# EAGLE design DUE_Xbee_v1 (EAGLE 9.6.2)
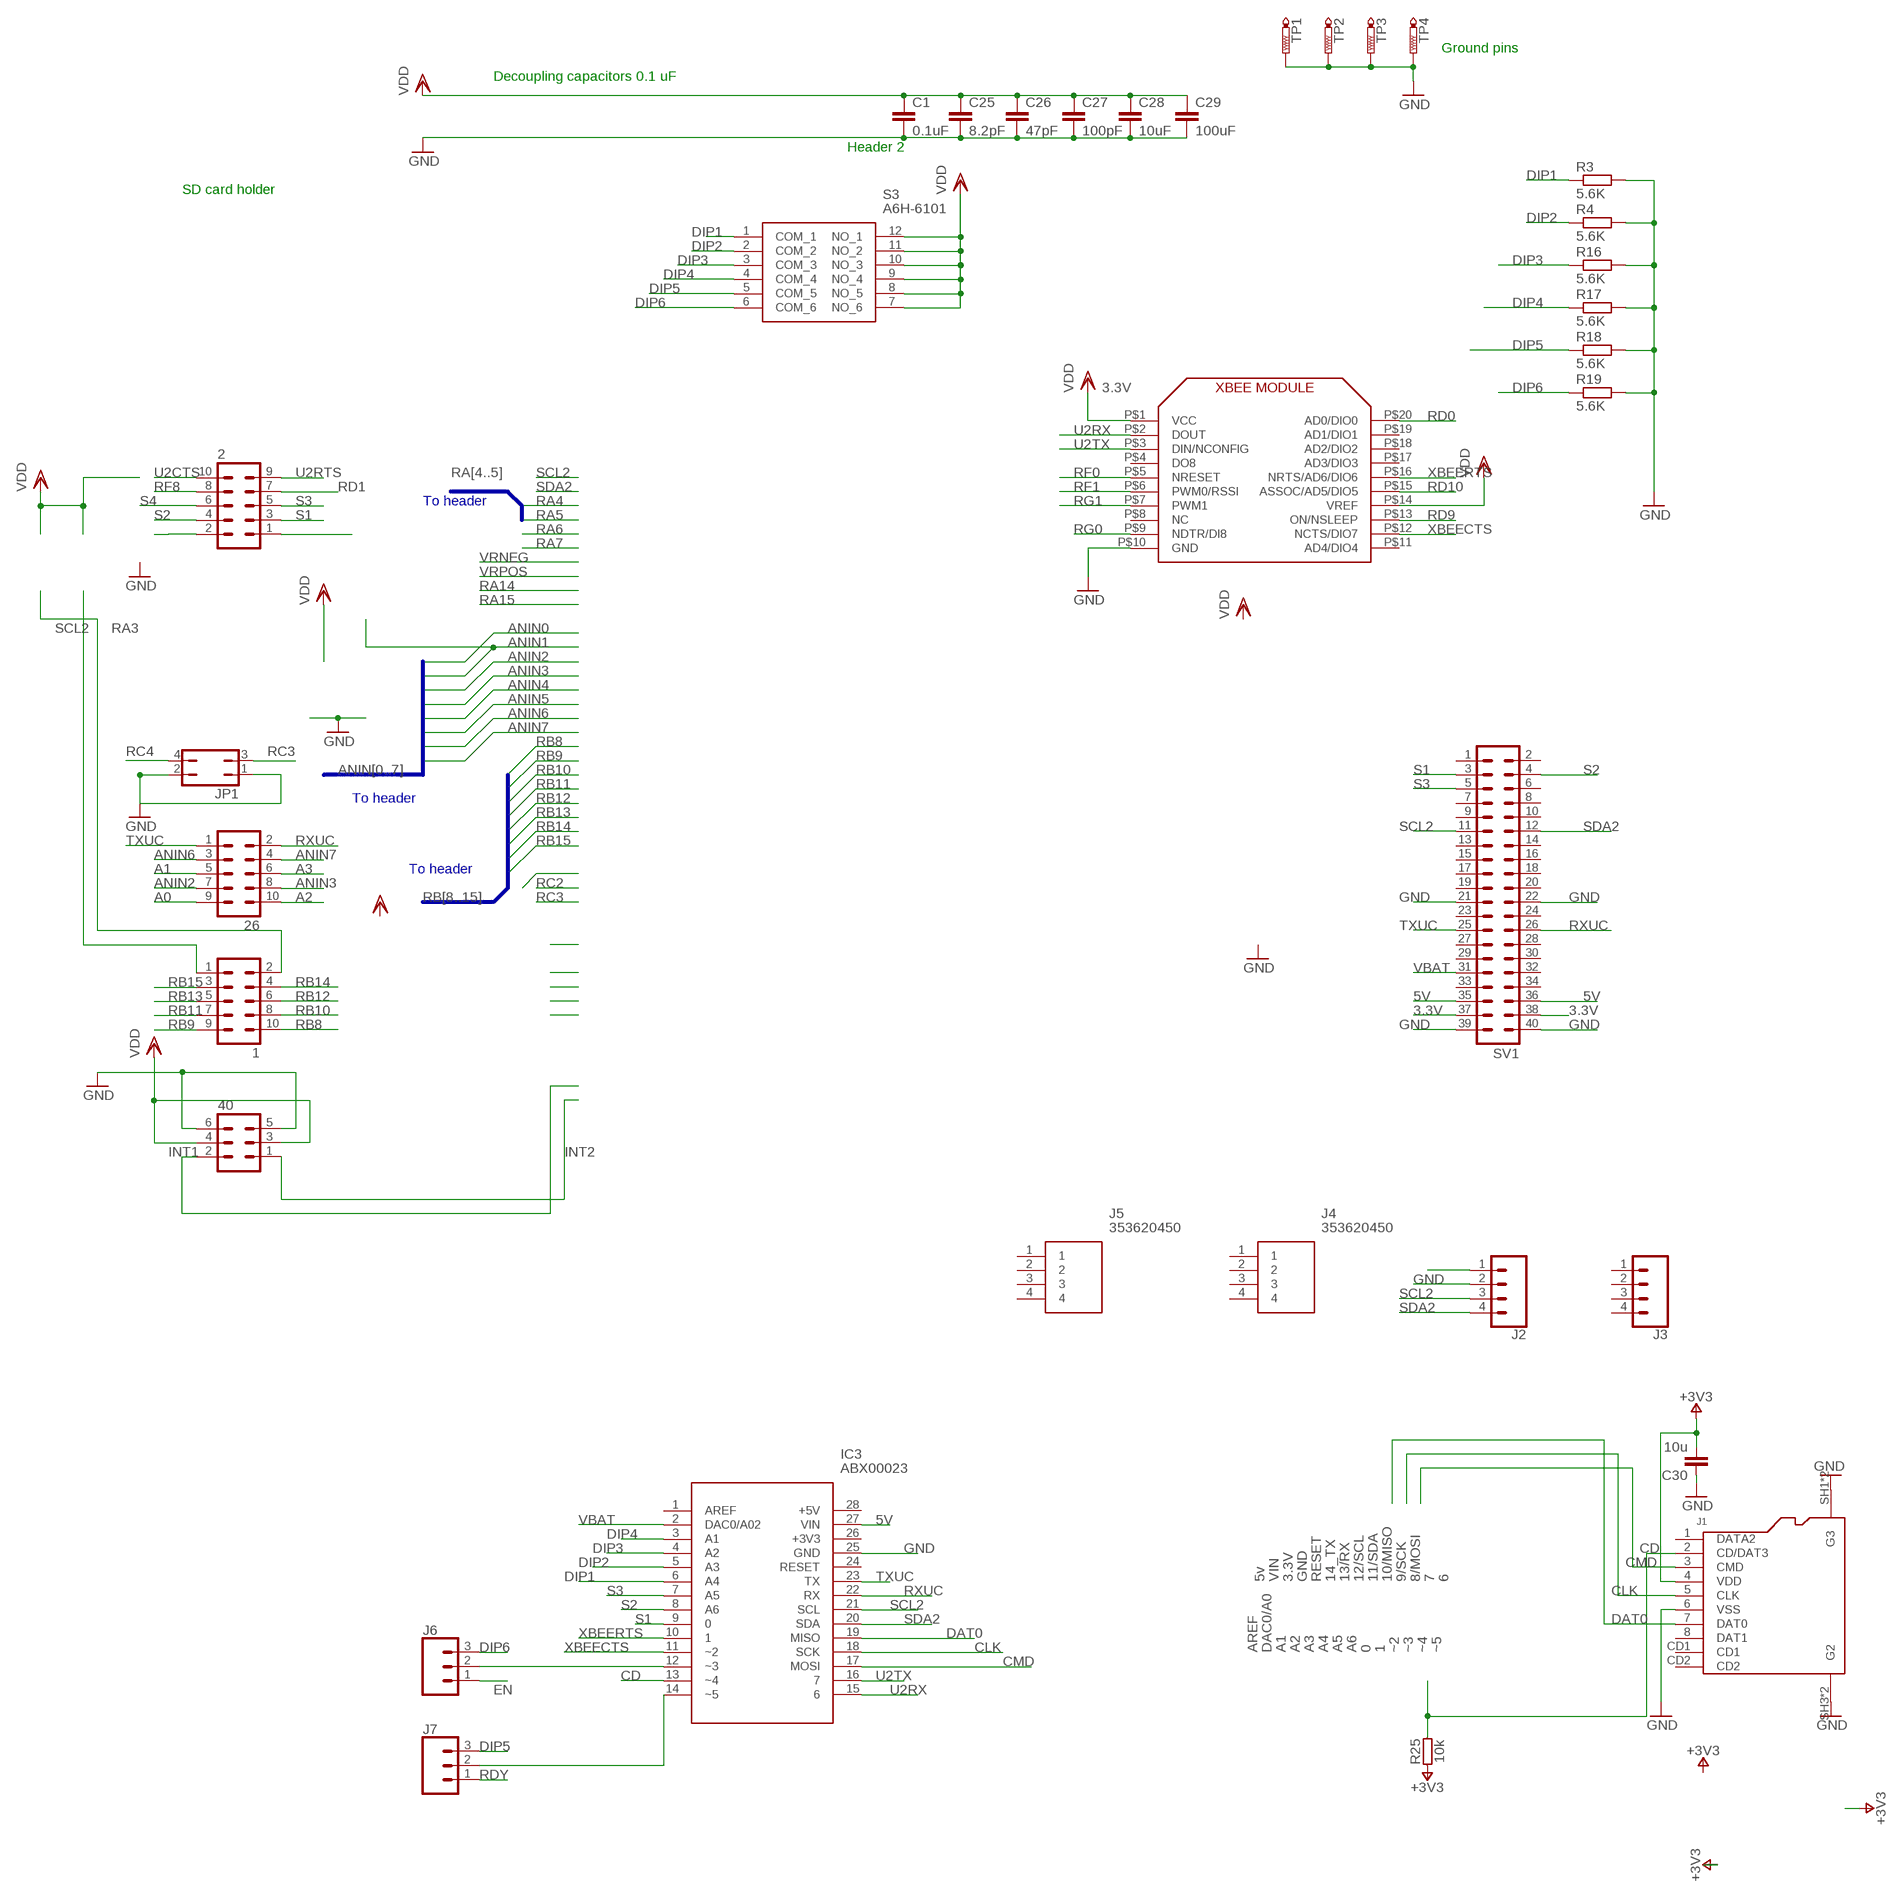
[diagram p0: schematic, sheet 1, part 1 of 2]
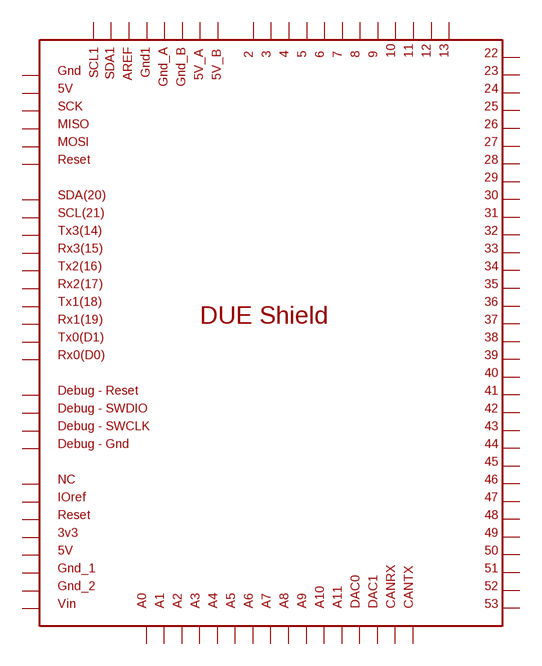
[diagram p1: schematic, sheet 1, part 2 of 2]

## Parts
1  MA05-2  [MA05-2]
2  MA05-2  [MA05-2]
26  MA05-2  [MA05-2]
40  MA03-2  [MA03-2]
C1  0.1uF  C-EUC0805K  [C0805K]
C25  8.2pF  C-EUC0805K  [C0805K]
C26  47pF  C-EUC0805K  [C0805K]
C27  100pF  C-EUC0805K  [C0805K]
C28  10uF  C-EUC0805K  [C0805K]
C29  100uF  C-EUC0805K  [C0805K]
C30  10u  C-22U-0805  [0805-R2013X50N]
IC3  ABX00023  [ABX00023]
J1  AMPHENOL_114-00841-68  [AMPHENOL_114-00841-68]
J2  CONN_04POLAR_LOCK  [MOLEX-1X4_LOCK]
J3  CONN_04POLAR_LOCK  [MOLEX-1X4_LOCK]
J4  353620450  [SHDR4W50P0X200_1X4_1030X550X85]
J5  353620450  [SHDR4W50P0X200_1X4_1030X550X85]
J6  CONN_03LOCK  [1X03_LOCK]
J7  CONN_03LOCK  [1X03_LOCK]
JP1  JP2Q  [JP2Q]
R3  5.6K  R-EU_R0805  [R0805]
R4  5.6K  R-EU_R0805  [R0805]
R16  5.6K  R-EU_R0805  [R0805]
R17  5.6K  R-EU_R0805  [R0805]
R18  5.6K  R-EU_R0805  [R0805]
R19  5.6K  R-EU_R0805  [R0805]
R25  10k  R-DNP-0805  [0805-R2013X50N]
S3  A6H-6101  [A6H6101]
SV1  ML40  [ML40]
TP1  PTR1PAD1-13  [P1-13]
TP2  PTR1PAD1-13  [P1-13]
TP3  PTR1PAD1-13  [P1-13]
TP4  PTR1PAD1-13  [P1-13]
U$1  XBEE  [XBEE]
U$2  DUE(NORMAL)  [DUE(NORMAL)]

## Nets
3.3V: 40.3 40.4 C1.1 C25.1 C26.1 C27.1 C28.1 C29.1 J2.1 S3.7(NO_6) S3.8(NO_5) S3.9(NO_4) S3.10(NO_3) S3.11(NO_2) S3.12(NO_1) SV1.37 SV1.38 U$1.P$1(VCC) U$1.P$14(VREF) ; supply symbol labelled VDD
5V: IC3.27(VIN) SV1.35 SV1.36
+3V3: C30.2 J1.4(VDD) R25.1
A0: 26.9
A1: 26.5
A2: 26.10
A3: 26.6
ANIN2: 26.7
ANIN3: 26.8
ANIN6: 26.3
ANIN7: 26.4
CD: IC3.13(~4) J1.2(CD/DAT3) R25.2
CLK: IC3.18(SCK) J1.5(CLK)
CMD: IC3.17(MOSI) J1.3(CMD)
DAT0: IC3.19(MISO) J1.7(DAT0)
DIP1: IC3.6(A4) R3.1 S3.1(COM_1)
DIP2: IC3.5(A3) R4.1 S3.2(COM_2)
DIP3: IC3.4(A2) R16.1 S3.3(COM_3)
DIP4: IC3.3(A1) R17.1 S3.4(COM_4)
DIP5: J7.3 R18.1 S3.5(COM_5)
DIP6: J6.3 R19.1 S3.6(COM_6)
EN: J6.1
GND: 40.5 40.6 C1.2 C25.2 C26.2 C27.2 C28.2 C29.2 C30.1 IC3.25(GND) J1.6(VSS) J1.SH1(G3) J1.SH2(G3) J1.SH3(G2) J1.SH4(G2) J2.2 JP1.1 JP1.2 R3.2 R4.2 R16.2 R17.2 R18.2 R19.2 SV1.21 SV1.22 SV1.39 SV1.40 TP1.1(TP) TP2.1(TP) TP3.1(TP) TP4.1(TP) U$1.P$10(GND)
INT1: 40.2
INT2: 40.1
N$1: 2.2
N$2: IC3.12(~3) J6.2
N$5: 2.1
N$9: IC3.14(~5) J7.2
RA3: 1.2
RB8: 1.10
RB9: 1.9
RB10: 1.8
RB11: 1.7
RB12: 1.6
RB13: 1.5
RB14: 1.4
RB15: 1.3
RC3: JP1.3
RC4: JP1.4
RD0: U$1.P$20(AD0/DIO0)
RD1: 2.7
RD9: U$1.P$13(ON/NSLEEP)
RD10: U$1.P$15(ASSOC/AD5/DIO5)
RDY: J7.1
RF0: U$1.P$5(NRESET)
RF1: U$1.P$6(PWM0/RSSI)
RF8: 2.8
RG0: U$1.P$9(NDTR/DI8)
RG1: U$1.P$7(PWM1)
RXUC: 26.2 IC3.22(RX) SV1.26
S1: 2.3 IC3.9 SV1.3
S2: 2.4 IC3.8(A6) SV1.4
S3: 2.5 IC3.7(A5) SV1.5
S4: 2.6
SCL2: 1.1 IC3.21(SCL) J2.3 SV1.11
SDA2: IC3.20(SDA) J2.4 SV1.12
TXUC: 26.1 IC3.23(TX) SV1.25
U2CTS: 2.10
U2RTS: 2.9
U2RX: IC3.15 U$1.P$2(DOUT)
U2TX: IC3.16 U$1.P$3(DIN/NCONFIG)
VBAT: IC3.2(DAC0/A02) SV1.31
XBEECTS: IC3.11(~2) U$1.P$12(NCTS/DIO7)
XBEERTS: IC3.10 U$1.P$16(NRTS/AD6/DIO6)
Unconnected: IC3.1(AREF) IC3.24(RESET) IC3.26(+3V3) IC3.28(+5V) J1.1(DATA2) J1.8(DAT1) J1.CD1 J1.CD2 J3.1 J3.2 J3.3 J3.4 J4.1 J4.2 J4.3 J4.4 J5.1 J5.2 J5.3 J5.4 SV1.1 SV1.2 SV1.6 SV1.7 SV1.8 SV1.9 SV1.10 SV1.13 SV1.14 SV1.15 SV1.16 SV1.17 SV1.18 SV1.19 SV1.20 SV1.23 SV1.24 SV1.27 SV1.28 SV1.29 SV1.30 SV1.32 SV1.33 SV1.34 U$1.P$4(DO8) U$1.P$8(NC) U$1.P$11(AD4/DIO4) U$1.P$17(AD3/DIO3) U$1.P$18(AD2/DIO2) U$1.P$19(AD1/DIO1) U$2.2 U$2.3 U$2.3V3 U$2.4 U$2.5 U$2.5V U$2.5V_A U$2.5V_B U$2.5V_ICSP U$2.6 U$2.7 U$2.8 U$2.9 U$2.10 U$2.11 U$2.12 U$2.13 U$2.22 U$2.23 U$2.24 U$2.25 U$2.26 U$2.27 U$2.28 U$2.29 U$2.30 U$2.31 U$2.32 U$2.33 U$2.34 U$2.35 U$2.36 U$2.37 U$2.38 U$2.39 U$2.40 U$2.41 U$2.42 U$2.43 U$2.44 U$2.45 U$2.46 U$2.47 U$2.48 U$2.49 U$2.50 U$2.51 U$2.52 U$2.53 U$2.A0 U$2.A1 U$2.A2 U$2.A3 U$2.A4 U$2.A5 U$2.A6 U$2.A7 U$2.A8 U$2.A9 U$2.A10 U$2.A11 U$2.AREF U$2.CANRX U$2.CANTX U$2.DAC0 U$2.DAC1 U$2.GND1 U$2.GND_1 U$2.GND_2 U$2.GND_A U$2.GND_B U$2.GND_DEBUG U$2.GND_ICSP U$2.IOREF U$2.MISO_ICSP U$2.MOSI_ICSP U$2.NC U$2.RESET U$2.RESET_DEBUG U$2.RESET_ICSP U$2.RX0 U$2.RX1 U$2.RX2 U$2.RX3 U$2.SCK_ICSP U$2.SCL U$2.SCL1 U$2.SDA U$2.SDA1 U$2.SWCLK_DEBUG U$2.SWDIO_DEBUG U$2.TX0 U$2.TX1 U$2.TX2 U$2.TX3 U$2.VIN

## Buses
ANIN[0..7]
RB[8..15]
RA[4..5]

## Notes on the sheet
- Ground pins
- Decoupling capacitors 0.1 uF
- Header 2
- SD card holder
- To header
- To header
- To header
- 5v | VIN | 3.3V | GND | RESET | 14_TX | 13/RX | 12/SCL | 11/SDA | 10/MISO | 9/SCK | 8/MOSI | 7 | 6
- AREF | DAC0/A0 | A1 | A2 | A3 | A4 | A5 | A6 | 0 | 1 | ~2 | ~3 | ~4 | ~5

## Library data of the parts
1 2 26 = con-lstb:MA05-2: PIN HEADER
40 = con-lstb:MA03-2: PIN HEADER
C1 C25-C29 = rcl:C-EU: CAPACITOR, European symbol
C30 = Arduino-rcl:C: SMD Capacitor; DATASHEET: https://media.digikey.com/pdf/Data%20Sheets/Samsung%20PDFs/CL21A226MQCLQNC_character.pdf; DISTRIBUTOR-LINK: https://www.digikey.com/product-detail/en/samsung-electro-mechanics-america-inc/CL21A226MQCLQNC/1276-2412-1-ND/3890498; DISTRIBUTOR-PN: 1276-2412-1-ND; MANUFACTURER: Samsung; MANUFACTURER-PN: CL21A226MQCLQNC; VALUE: 22u
IC3 = SamacSys_Parts:ABX00023: ARDUINO MKR WIFI 1010 Source: Datasheet <https://store.arduino.cc/arduino-mkr-wifi-1010>; ARROW_PART_NUMBER: ABX00023; ARROW_PRICE-STOCK: https://www.arrow.com/en/products/abx00023/arduino-corporation; DESCRIPTION: ARDUINO MKR WIFI 1010; HEIGHT: 3mm; MANUFACTURER_NAME: Arduino; MANUFACTURER_PART_NUMBER: ABX00023; MOUSER_PART_NUMBER: 782-ABX00023; MOUSER_PRICE-STOCK: https://www.mouser.co.uk/ProductDetail/Arduino/ABX00023?qs=%252BEew9%252B0nqrAwxv2YQYWyPw%3D%3D
J1 = Arduino-connectors:AMPHENOL_114-00841-68
J2 J3 = SparkFun-Connectors:CONN_04: Multi connection point. Often used as Generic Header-pin footprint for 0.1 inch spaced/style header connections On any of the 0.1 inch spaced packages, you can populate with these: Break Away Headers - Straight <https://www.sparkfun.com/products/116> (PRT-00116) Break Away Male Headers - Right Angle <https://www.sparkfun.com/products/553> (PRT-00553) Female Headers <https://www.sparkfun.com/products/115> (PRT-00115) Break Away Headers - Machine Pin <https://www.sparkfun.com/products/117> (PRT-00117) Break Away Female Headers - Swiss Machine Pin <https://www.sparkfun.com/products/743> (PRT-00743) For SCREWTERMINALS and SPRING TERMINALS visit here: Screw Terimnals on SparkFun.com <https://www.sparkfun.com/search/results?term=Screw+Terminals> (5mm/3.5mm/2.54mm spacing) This device is also useful as a general connection point to wire up your design to another part of your project. Our various solder wires solder well into these plated through hole pads. Hook-Up Wire - Assortment (Stranded, 22 AWG) <https://www.sparkfun.com/products/11375> (PRT-11375) Hook-Up Wire - Assortment (Solid Core, 22 AWG) <https://www.sparkfun.com/products/11367> (PRT-11367) View the entire wire category on our website here <https://www.sparkfun.com/categories/141> Special notes: Molex polarized connector foot print use with SKU : PRT-08231 with associated crimp pins and housings. 1MM SMD Version SKU: PRT-10208; PROD_ID: CONN-08186; SF_ID: PRT-08231
J4 J5 = SamacSys_Parts:353620450: MOLEX - 353620450 - CONNECTOR, HEADER, 4POS, 1ROW, 2MM Source: Datasheet <https://www.molex.com/pdm_docs/sd/353620450_sd.pdf>; DESCRIPTION: MOLEX - 353620450 - CONNECTOR, HEADER, 4POS, 1ROW, 2MM; HEIGHT: 8.5mm; MANUFACTURER_NAME: Molex; MANUFACTURER_PART_NUMBER: 353620450
J6 J7 = SparkFun-Connectors:CONN_03: Multi connection point. Often used as Generic Header-pin footprint for 0.1 inch spaced/style header connections On any of the 0.1 inch spaced packages, you can populate with these: Break Away Headers - Straight <https://www.sparkfun.com/products/116> (PRT-00116) Break Away Male Headers - Right Angle <https://www.sparkfun.com/products/553> (PRT-00553) Female Headers <https://www.sparkfun.com/products/115> (PRT-00115) Break Away Headers - Machine Pin <https://www.sparkfun.com/products/117> (PRT-00117) Break Away Female Headers - Swiss Machine Pin <https://www.sparkfun.com/products/743> (PRT-00743) Stackable Header - 3 Pin (Female, 0.1") <https://www.sparkfun.com/products/13875> (PRT-13875) For SCREWTERMINALS and SPRING TERMINALS visit here: Screw Terimnals on SparkFun.com <https://www.sparkfun.com/search/results?term=Screw+Terminals> (5mm/3.5mm/2.54mm spacing) This device is also useful as a general connection point to wire up your design to another part of your project. Our various solder wires solder well into these plated through hole pads. Hook-Up Wire - Assortment (Stranded, 22 AWG) <https://www.sparkfun.com/products/11375> (PRT-11375) Hook-Up Wire - Assortment (Solid Core, 22 AWG) <https://www.sparkfun.com/products/11367> (PRT-11367) View the entire wire category on our website here <https://www.sparkfun.com/categories/141> Special notes: Molex polarized connector foot print use with SKU : PRT-08232 with associated crimp pins and housings.
JP1 = jumper:JP2Q: JUMPER
R3 R4 R16-R19 = rcl:R-EU_: RESISTOR, European symbol
R25 = Arduino-rcl:R: SMD Resistor; DATASHEET: DNP; DISTRIBUTOR-LINK: DNP; DISTRIBUTOR-PN: DNP; MANUFACTURER: DNP; MANUFACTURER-PN: DNP; VALUE: DNP
S3 = SamacSys_Parts:A6H-6101: OMRON ELECTRONIC COMPONENTS - A6H-6101 - SWITCH, DIP, 1/2 PITCH, SMD Source: Datasheet <http://omronfs.omron.com/en_US/ecb/products/pdf/en-a6h.pdf>; ARROW_PART_NUMBER: A6H-6101; ARROW_PRICE-STOCK: https://www.arrow.com/en/products/a6h-6101/omron?region=nac; DESCRIPTION: OMRON ELECTRONIC COMPONENTS - A6H-6101 - SWITCH, DIP, 1/2 PITCH, SMD; HEIGHT: 1.55mm; MANUFACTURER_NAME: Omron Electronics; MANUFACTURER_PART_NUMBER: A6H-6101; MOUSER_PART_NUMBER: 653-A6H-6101; MOUSER_PRICE-STOCK: https://www.mouser.co.uk/ProductDetail/Omron-Electronics/A6H-6101?qs=HDDQUw%2F3PhptqbHjvn4x5A%3D%3D
SV1 = con-harting-ml:ML40: HARTING; OC_FARNELL: unknown; OC_NEWARK: unknown
TP1-TP4 = testpad:PTR1: TEST PIN
U$1 = XBEE:XBEE
U$2 = DUElib130425:DUE(NORMAL)

## Board
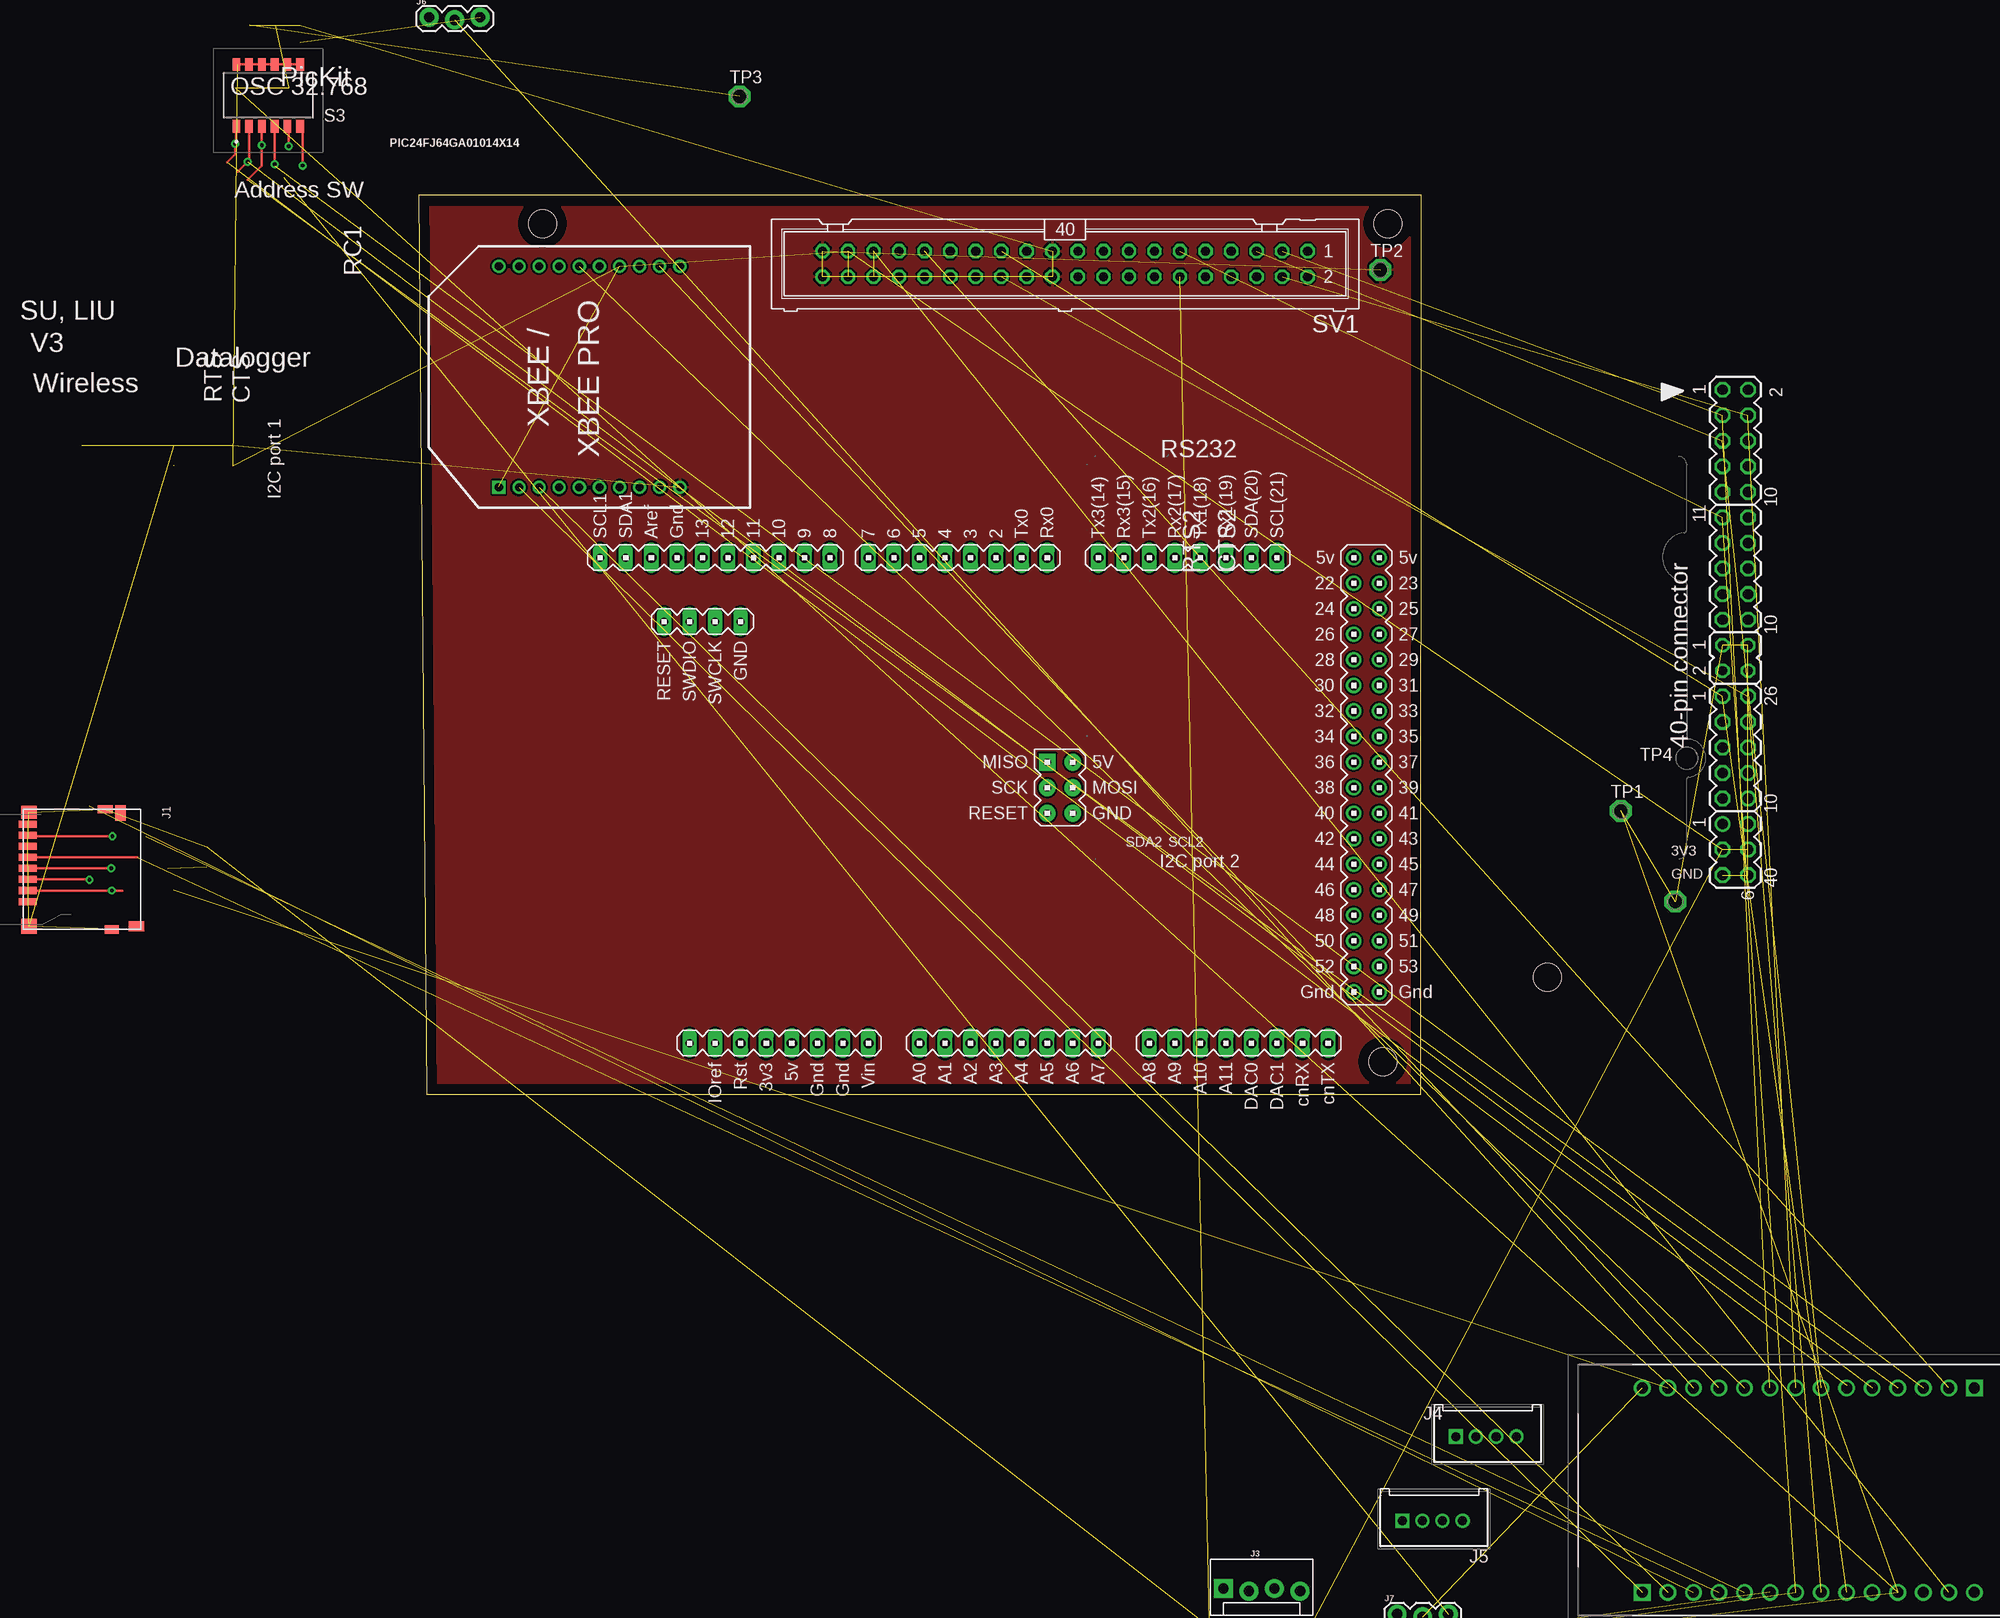
[diagram p2: board, top side]
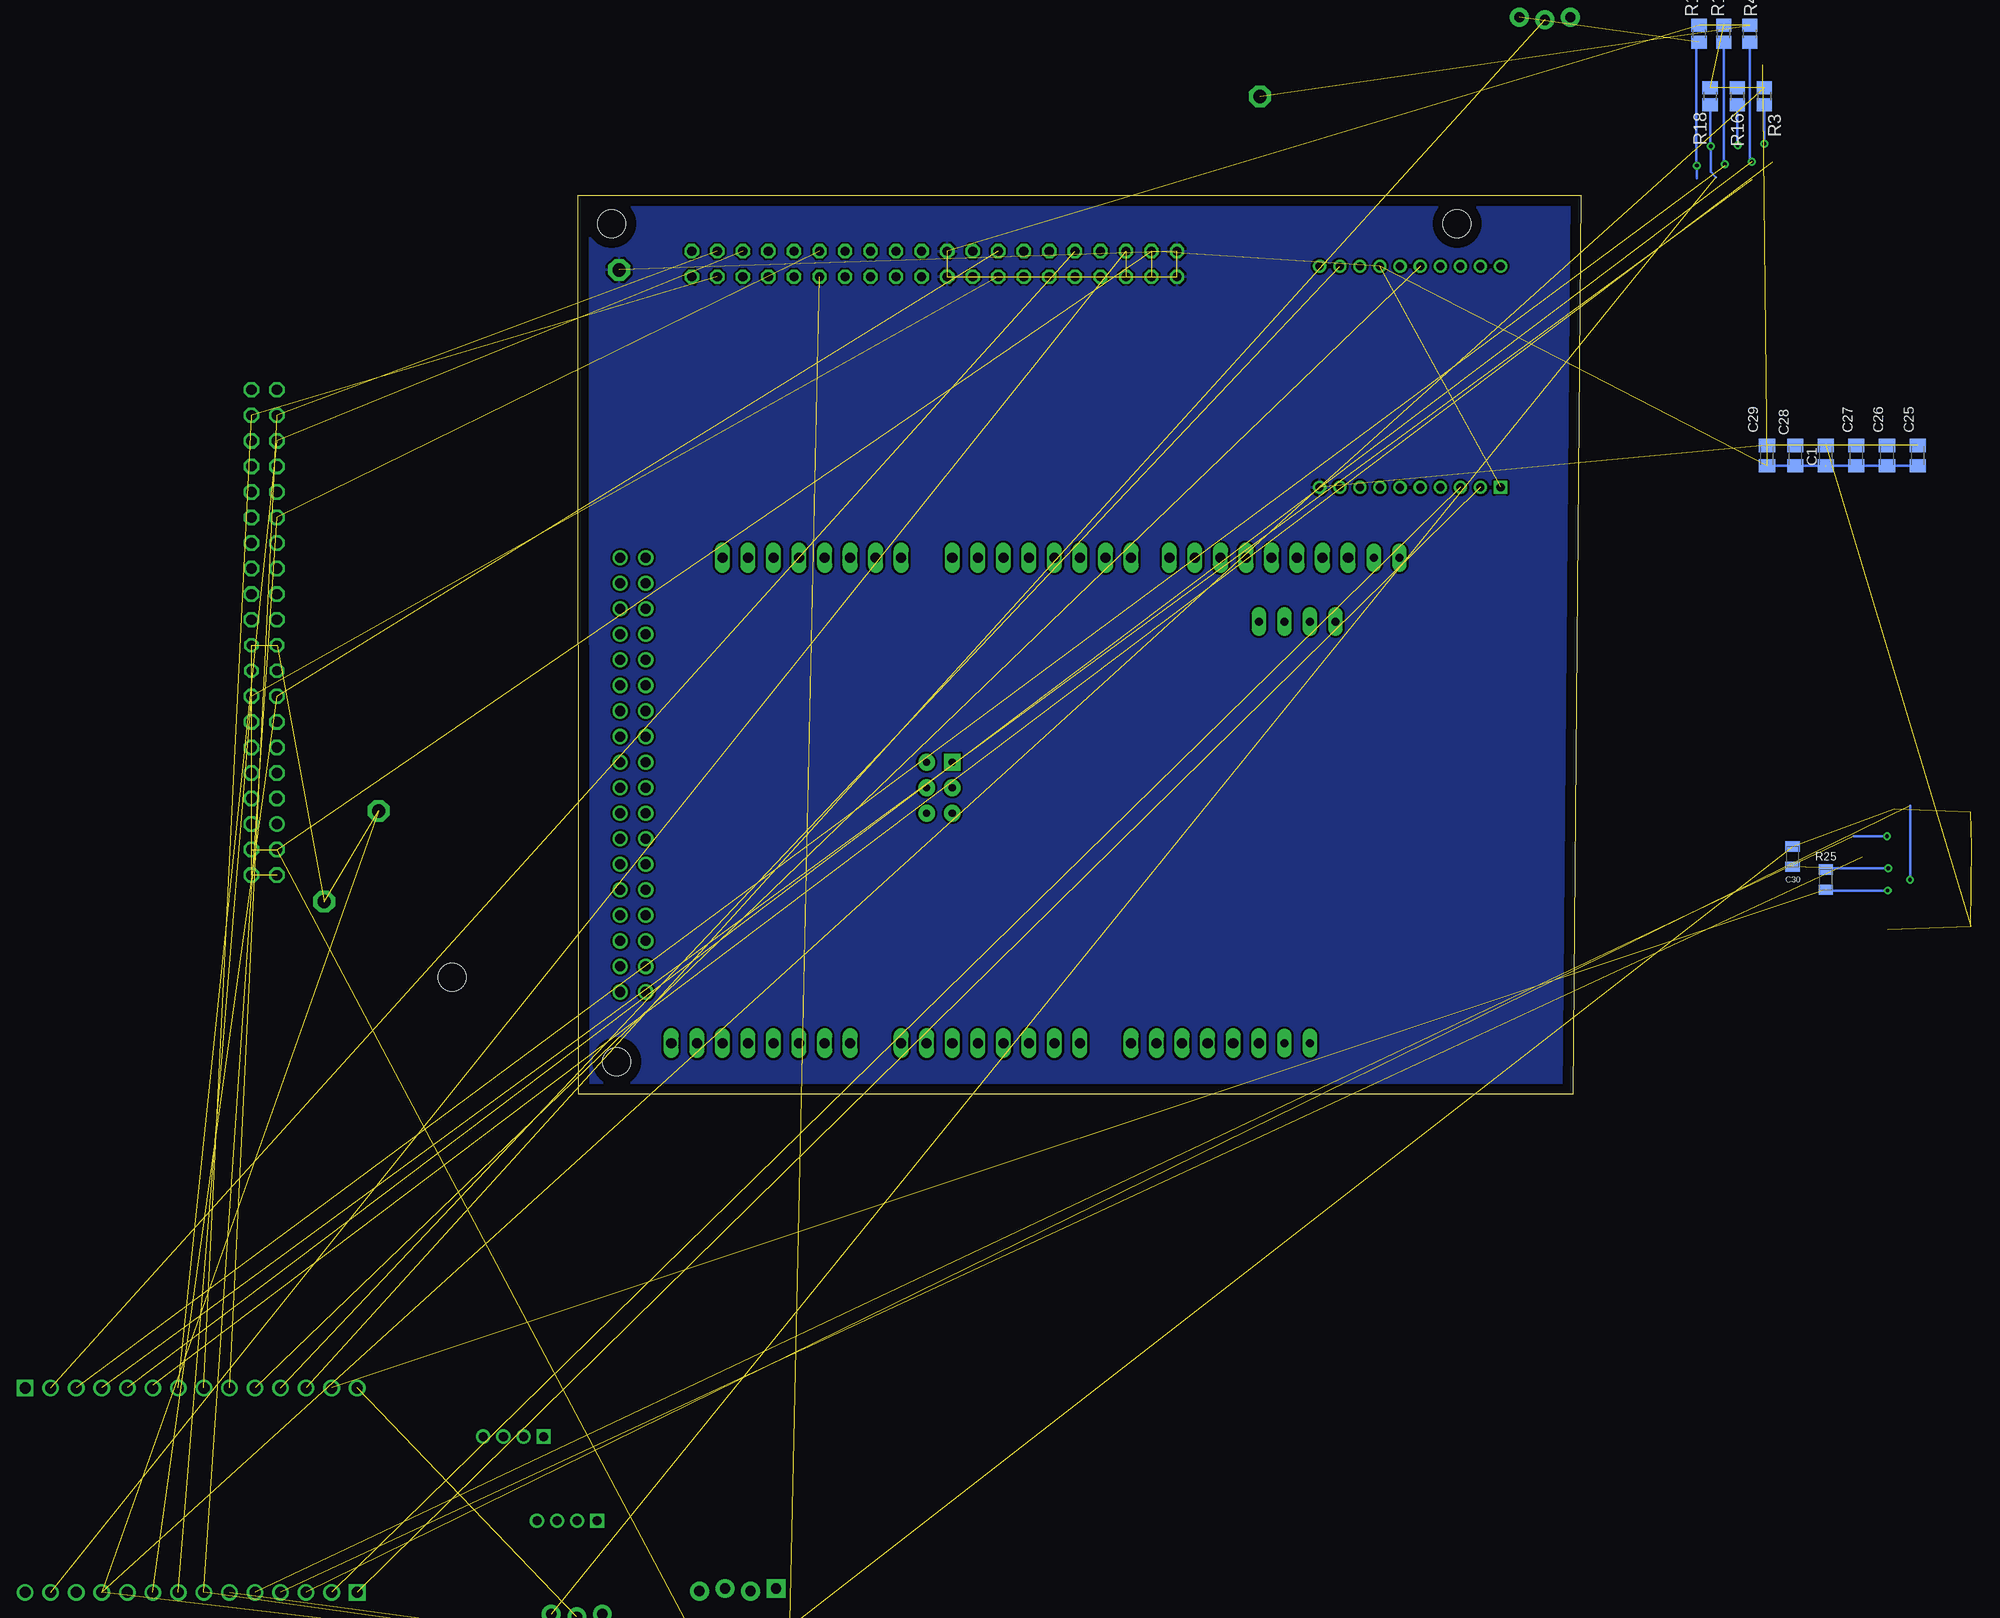
[diagram p3: board, bottom side, seen from below]

Size 99.73 x 89.42 mm. Coordinates in mm from the lower left corner, seen from the top.
Outline: 0.8,0.02 99.68,0 99.73,89.42 0,89.42 0.8,0.02
Copper layers (1*16): Top 0.035mm / dielectric 1.5mm / Bottom 0.035mm
Design rules "default": minimum track width 10mil, minimum drill 15mil, track to track 8mil, track to pad 8mil, pad to pad 8mil, via to via 8mil, smd to smd 8mil, copper to edge 40mil, drill to drill 8mil, minimum pad ring 10mil, minimum via ring 8mil, stop-mask expansion 4mil, vias tented up to drill 0mil, thermal gap 10mil
Holes 2.8 mm at 95.89,3.26 96.4,86.57 12.33,86.57 112.24,11.64

### Footprints (pad centres in the part's own frame; a part is rotated, then mirrored left to right if it is on the bottom)
MA05-2 = drill 1.016 octagon: 1 -5.08,-1.27; 2 -5.08,1.27; 3 -2.54,-1.27; 4 -2.54,1.27; 5 0,-1.27; 6 0,1.27; 7 2.54,-1.27; 8 2.54,1.27; 9 5.08,-1.27; 10 5.08,1.27
MA03-2 = drill 1.016: 1 -2.54,-1.27 | drill 1.016 octagon: 2 -2.54,1.27; 3 0,-1.27; 4 0,1.27; 5 2.54,-1.27; 6 2.54,1.27
C0805K = smd 1.3 x 1.6: 1 -1,0; 2 1,0
0805-R2013X50N = smd 0.95 x 1.45: 1 -1,0; 2 1,0
ABX00023 = drill 1.1 pad 1.65 square: 1 0,0; 15 33.02,20.32 | drill 1.1 pad 1.65: 2 2.54,0; 3 5.08,0; 4 7.62,0; 5 10.16,0; 6 12.7,0; 7 15.24,0; 8 17.78,0; 9 20.32,0; 10 22.86,0; 11 25.4,0; 12 27.94,0; 13 30.48,0; 14 33.02,0; 16 30.48,20.32; 17 27.94,20.32; 18 25.4,20.32; 19 22.86,20.32; 20 20.32,20.32; 21 17.78,20.32; 22 15.24,20.32; 23 12.7,20.32; 24 10.16,20.32; 25 7.62,20.32; 26 5.08,20.32; 27 2.54,20.32; 28 0,20.32
AMPHENOL_114-00841-68 = smd 0.7 x 1.75: 1 3.2,-5.888; 2 2.1,-5.888; 3 1,-5.888; 4 -0.1,-5.888; 5 -1.2,-5.888; 6 -2.3,-5.888; 7 -3.4,-5.888; 8 -4.5,-5.888 | smd 1 x 1.55: CD1 5.65,4.912 | smd 1.55 x 1: CD2 -5.602,3.337 | smd 1.3 x 1.5: SH1 -5.7,-5.76 | smd 1.5 x 1.5: SH2 5.65,-5.76 | smd 0.8 x 1.4: SH3 5.975,2.487 | smd 0.8 x 1.5: SH4 -5.975,1.837
MOLEX-1X4_LOCK = drill 1.016 pad 1.88 square: 1 0,0.127 | drill 1.016 pad 1.88: 2 2.54,-0.127; 3 5.08,0.127; 4 7.62,-0.127
SHDR4W50P0X200_1X4_1030X550X85 = drill 0.9 pad 1.35 square: 1 0,0 | drill 0.9 pad 1.35: 2 -2,0; 3 -4,0; 4 -6,0
1X03_LOCK = drill 1.016 pad 1.88: 1 0,0.127; 2 2.54,-0.127; 3 5.08,0.127
JP2Q = drill 0.914 octagon: 1 -1.27,-1.27; 2 -1.27,1.27; 3 1.27,-1.27; 4 1.27,1.27
R0805 = smd 1.3 x 1.5: 1 -0.85,0; 2 0.85,0
A6H6101 = smd 0.76 x 1.25: 1 -3.175,-3.075; 2 -1.905,-3.075; 3 -0.635,-3.075; 4 0.635,-3.075; 5 1.905,-3.075; 6 3.175,-3.075; 7 3.175,3.075; 8 1.905,3.075; 9 0.635,3.075; 10 -0.635,3.075; 11 -1.905,3.075; 12 -3.175,3.075
ML40 = drill 0.914 octagon: 1 -24.13,-1.27; 2 -24.13,1.27; 3 -21.59,-1.27; 4 -21.59,1.27; 5 -19.05,-1.27; 6 -19.05,1.27; 7 -16.51,-1.27; 8 -16.51,1.27; 9 -13.97,-1.27; 10 -13.97,1.27; 11 -11.43,-1.27; 12 -11.43,1.27; 13 -8.89,-1.27; 14 -8.89,1.27; 15 -6.35,-1.27; 16 -6.35,1.27; 17 -3.81,-1.27; 18 -3.81,1.27; 19 -1.27,-1.27; 20 -1.27,1.27; 21 1.27,-1.27; 22 1.27,1.27; 23 3.81,-1.27; 24 3.81,1.27; 25 6.35,-1.27; 26 6.35,1.27; 27 8.89,-1.27; 28 8.89,1.27; 29 11.43,-1.27; 30 11.43,1.27; 31 13.97,-1.27; 32 13.97,1.27; 33 16.51,-1.27; 34 16.51,1.27; 35 19.05,-1.27; 36 19.05,1.27; 37 21.59,-1.27; 38 21.59,1.27; 39 24.13,-1.27; 40 24.13,1.27
P1-13 = drill 1.321 pad 2.159 octagon: 1 0,0
XBEE = drill 0.8 square: P$1 -11,10 | drill 0.8: P$2 -11,8; P$3 -11,6; P$4 -11,4; P$5 -11,2; P$6 -11,0; P$7 -11,-2; P$8 -11,-4; P$9 -11,-6; P$10 -11,-8; P$11 11,-8; P$12 11,-6; P$13 11,-4; P$14 11,-2; P$15 11,0; P$16 11,2; P$17 11,4; P$18 11,6; P$19 11,8; P$20 11,10
DUE(NORMAL) = drill 1 long: 2 -16.51,30.48; 3 -19.05,30.48; 3V3 -39.37,-17.78; 4 -21.59,30.48; 5 -24.13,30.48; 5V -36.83,-17.78; 6 -26.67,30.48; 7 -29.21,30.48; 8 -33.02,30.48; 9 -35.56,30.48; 10 -38.1,30.48; 11 -40.64,30.48; 12 -43.18,30.48; 13 -45.72,30.48; A0 -24.13,-17.78; A1 -21.59,-17.78; A2 -19.05,-17.78; A3 -16.51,-17.78; A4 -13.97,-17.78; A5 -11.43,-17.78; A6 -8.89,-17.78; A7 -6.35,-17.78; A8 -1.27,-17.78; A9 1.27,-17.78; A10 3.81,-17.78; A11 6.35,-17.78; AREF -50.8,30.48; AREF1 -50.8,30.48; CANRX 13.97,-17.78; CANTX 16.51,-17.78; DAC0 8.89,-17.78; DAC1 11.43,-17.78; GND1 -48.26,30.48; GND_1 -34.29,-17.78; GND_2 -31.75,-17.78; RESET -41.91,-17.78; RX0 -11.43,30.48; RX1 6.35,30.48; RX2 1.27,30.48; RX3 -3.81,30.48; SCL 11.43,30.48; SDA 8.89,30.48; TX0 -13.97,30.48; TX1 3.81,30.48; TX2 -1.27,30.48; TX3 -6.35,30.48; VIN -29.21,-17.78 | drill 1: 5V_A 19.05,30.48; 5V_B 21.59,30.48; 22 19.05,27.94; 23 21.59,27.94; 24 19.05,25.4; 25 21.59,25.4; 26 19.05,22.86; 27 21.59,22.86; 28 19.05,20.32; 29 21.59,20.32; 30 19.05,17.78; 31 21.59,17.78; 32 19.05,15.24; 33 21.59,15.24; 34 19.05,12.7; 35 21.59,12.7; 36 19.05,10.16; 37 21.59,10.16; 38 19.05,7.62; 39 21.59,7.62; 40 19.05,5.08; 41 21.59,5.08; 42 19.05,2.54; 43 21.59,2.54; 44 19.05,0; 45 21.59,0; 46 19.05,-2.54; 47 21.59,-2.54; 48 19.05,-5.08; 49 21.59,-5.08; 50 19.05,-7.62; 51 21.59,-7.62; 52 19.05,-10.16; 53 21.59,-10.16; GND_A 19.05,-12.7; GND_B 21.59,-12.7 | drill 0.7 pad 1.676: 5V_ICSP -8.89,5.08; GND_ICSP -8.89,10.16; MOSI_ICSP -8.89,7.62; RESET_ICSP -11.43,5.08; SCK_ICSP -11.43,7.62 | drill 0.8 pad 1.422 long: GND_DEBUG -41.91,24.13; IOREF -44.45,-17.78; NC -46.99,-17.78; RESET_DEBUG -49.53,24.13; SCL1 -55.88,30.48; SDA1 -53.34,30.48; SWCLK_DEBUG -44.45,24.13; SWDIO_DEBUG -46.99,24.13 | drill 0.7 pad 1.676 square: MISO_ICSP -11.43,10.16

### Placement (x,y rotation side)
1  130.94,52.28 270 top  (outside the outline)
2  130.94,64.98 270 top  (outside the outline)
26  130.94,34.5 270 top  (outside the outline)
40  130.94,24.34 270 top  (outside the outline)
C1  -24.35,63.52 90 bottom  (outside the outline)
C25  -33.49,63.52 90 bottom  (outside the outline)
C26  -30.45,63.52 90 bottom  (outside the outline)
C27  -27.4,63.52 90 bottom  (outside the outline)
C28  -21.3,63.52 90 bottom  (outside the outline)
C29  -18.51,63.52 90 bottom  (outside the outline)
C30  -21.05,23.65 270 bottom  (outside the outline)
IC3  154.72,-29.19 180 top  (outside the outline)
J1  -32.99,22.38 270 top  (outside the outline)
J2  86.39,-57.13 180 top  (outside the outline)
J3  80.04,-49.25 0 top  (outside the outline)
J4  103.16,-34.01 180 top  (outside the outline)
J5  97.82,-42.39 180 top  (outside the outline)
J6  1.05,106.96 0 top  (outside the outline)
J7  97.32,-51.79 0 top  (outside the outline)
JP1  130.94,43.39 270 top  (outside the outline)
R3  -18.25,99.24 90 bottom  (outside the outline)
R4  -16.8,105.46 90 bottom  (outside the outline)
R16  -15.55,99.24 90 bottom  (outside the outline)
R17  -14.2,105.46 90 bottom  (outside the outline)
R18  -12.85,99.24 90 bottom  (outside the outline)
R19  -11.75,105.46 90 bottom  (outside the outline)
R25  -24.35,21.36 270 bottom  (outside the outline)
S3  -14.95,99.34 0 top  (outside the outline)
SV1  64.3,82.57 180 top
TP1  119.55,28.19 0 top  (outside the outline)
TP2  95.65,81.97 0 top
TP3  31.92,99.22 0 top  (outside the outline)
TP4  124.98,19.17 0 top  (outside the outline)
U$1  17.98,71.35 90 top
U$2  73.95,22.88 0 top

### Tracks (layer width: path | path; a pad name or v marks a point on that pad's centre or on a via)
3.3V  (9 unrouted)
  Top 0.254: S3.12 -18,102.41 | -18,102.41 S3.11 S3.10 S3.9 S3.8 S3.7 | -18.03,102.39 -18,102.41
  Bottom 0.254: 7.98,60.43 U$1.P$1 | -24.29,62.52 C27.1 C26.1 -33.34,62.52 -33.42,62.45 C25.1 | C28.1 | C28.1 C29.1 -18.49,62.51 | C1.1 C28.1
5V  (2 unrouted)
+3V3  (via drill 0.38)  (1 unrouted)
  Top 0.254: J1.4 v-30.56,22.48
  Bottom 0.254: R25.1 -24.97,22.48 v-30.56,22.48
CD  (via drill 0.38)  (1 unrouted)
  Top 0.254: J1.2 v-30.5,20.28 -29.45,20.28
  Bottom 0.254: v-30.5,20.28 -24.91,20.28 R25.2
CLK  (1 unrouted)
  Top 0.254: J1.5 -27.98,23.58
CMD  (via drill 0.38)  (1 unrouted)
  Top 0.254: J1.3 -32.75,21.38 v-32.73,21.36
  Bottom 0.254: -32.73,28.73 v-32.73,21.36
DAT0  (via drill 0.38)  (1 unrouted)
  Top 0.254: J1.7 -38.79,25.69 -30.45,25.69 v-30.45,25.68
  Bottom 0.254: -27.14,25.68 v-30.45,25.68
DIP1  (via drill 0.38)  (1 unrouted)
  Top 0.254: IC3.6 142.02,-28.93 | S3.1 -18.13,94.64 v-18.25,94.51 -18.25,93.5 -19.04,92.71
  Bottom 0.254: R3.1 v-18.25,94.52 v-18.25,94.51
DIP2  (via drill 0.38)  (1 unrouted)
  Top 0.254: S3.2 -16.86,92.86 v-16.98,92.74 v-16.99,92.74 -18.01,91.72
  Bottom 0.254: R4.1 -16.8,92.92 v-16.98,92.73 v-16.99,92.74
DIP3  (via drill 0.38)  (1 unrouted)
  Top 0.254: S3.3 v-15.59,94.39 -15.59,92.35 -16.98,90.96
  Bottom 0.254: R16.1 -15.55,94.42 v-15.59,94.39
DIP4  (via drill 0.38)  (1 unrouted)
  Top 0.254: S3.4 v-14.32,92.48 -14.32,92.35
  Bottom 0.254: R17.1 -14.2,92.47 -14.44,92.23 -14.44,92.35 v-14.32,92.48
DIP5  (via drill 0.38)  (1 unrouted)
  Top 0.254: S3.5 -12.92,96.14 v-12.92,94.26
  Bottom 0.254: R18.1 -12.85,94.33 v-12.92,94.26 -12.92,91.72 -13.43,91.21
DIP6  (via drill 0.38)  (1 unrouted)
  Top 0.254: v-11.52,92.35 -11.52,96.01 S3.6
  Bottom 0.254: R19.1 -11.5,104.36 -11.5,92.38 v-11.52,92.35 -11.52,91.08
GND  (32 unrouted)
  pour Bottom: 0.98,13.62 0.88,88.62 98.83,88.52 98.83,0.32 1.02,0.24
  pour Top: 0.83,0.27 0.83,88.57 98.83,88.57 98.83,0.27
N$2  (1 unrouted)
N$9  (1 unrouted)
RA3
  Bottom 0.254: 132.3,57.32 1.2 132.2,57.42 1.2 132.25,57.32
RD1
  Top 0.254: 2.7 129.65,62.42
RF8
  Top 0.254: 2.8
RXUC  (2 unrouted)
S1  (2 unrouted)
S2  (2 unrouted)
S3  (2 unrouted)
SCL2  (3 unrouted)
SDA2  (2 unrouted)
TXUC  (2 unrouted)
U2RX  (1 unrouted)
U2TX  (1 unrouted)
VBAT  (1 unrouted)
XBEECTS  (1 unrouted)
XBEERTS  (1 unrouted)

### Text on the board
tPlace: OSC 32.768 | PicKit | Address SW | RC1 | SU, LIU | V3 | Datalogger | Wireless | RTS | CTS | I2C port 1 | RS232 | RTS2 | CTS2 | 40-pin connector | SDA2 | SCL2 | I2C port 2 | 3V3 | GND | RTclk
tNames: PIC24FJ64GA01014X14